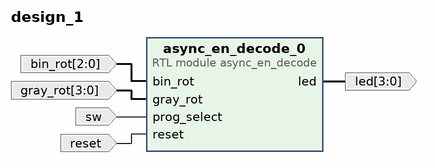
[diagram p0: block diagram of the top level]
# Vivado block design design_1, xc7z020clg400-1, Vivado 2023.2
create_bd_design design_1

create_bd_port -dir I -type rst reset
create_bd_port -dir I -from 3 -to 0 gray_rot
create_bd_port -dir O -from 3 -to 0 led
create_bd_port -dir I sw
create_bd_port -dir I -from 2 -to 0 bin_rot

create_bd_cell -type module -reference async_en_decode async_en_decode_0

# ---- connections ----

connect_bd_net [get_bd_pins async_en_decode_0/led] [get_bd_ports led]
connect_bd_net -net bin_rot_0_1 [get_bd_ports bin_rot] [get_bd_pins async_en_decode_0/bin_rot]
connect_bd_net -net gray_rot_0_1 [get_bd_ports gray_rot] [get_bd_pins async_en_decode_0/gray_rot]
connect_bd_net -net prog_select_0_1 [get_bd_ports sw] [get_bd_pins async_en_decode_0/prog_select]
connect_bd_net -net reset_0_1 [get_bd_ports reset] [get_bd_pins async_en_decode_0/reset]

validate_bd_design
save_bd_design
